# EAGLE schematic mrShark Programmer (EAGLE 6.1)
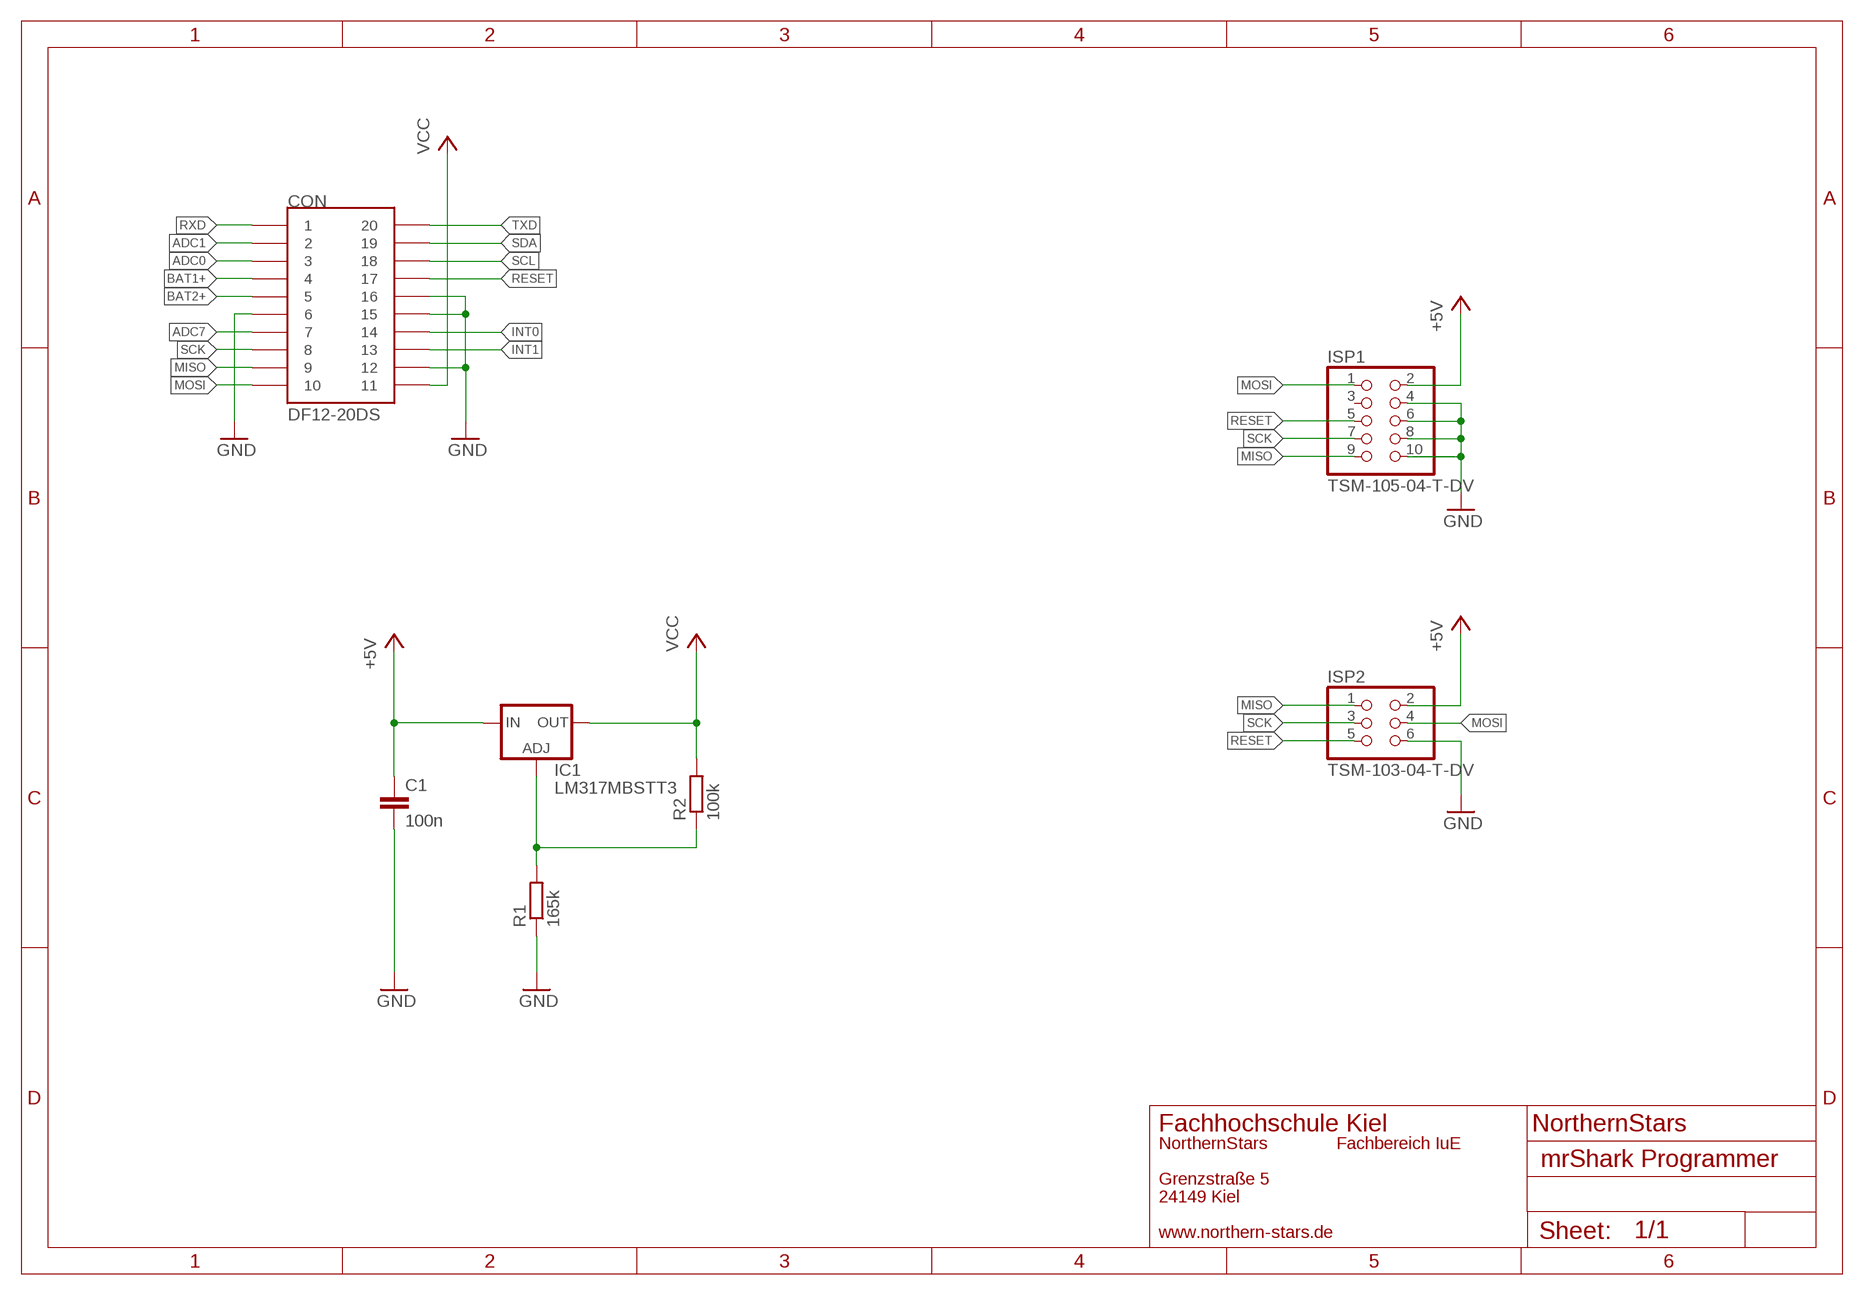
[diagram p0: schematic, sheet 1]

## Parts
C1  100n  C-EUC0201  [C0201]
CON  DF12-20DS  [DF12-20DS]
IC1  LM317MBSTT3  [SOT223]
ISP1  TSM-105-04-T-DV  PINHD-2X05_2.54-SMD  [2X05SMD]
ISP2  TSM-103-04-T-DV  PINHD-2X03_2.54-SMD  [2X03SMD]
R1  165k  R-EU_R0201  [R0201]
R2  100k  R-EU_R0201  [R0201]

## Nets
+5V: C1.1 IC1.3(IN) ISP1.2 ISP2.2
ADC0: CON.3
ADC1: CON.2
ADC7: CON.7
BAT1+: CON.4
BAT2+: CON.5
GND: C1.2 CON.6 CON.12 CON.15 CON.16 ISP1.4 ISP1.6 ISP1.8 ISP1.10 ISP2.6 R1.1
INT0: CON.14
INT1: CON.13
MISO: CON.9 ISP1.9 ISP2.1
MOSI: CON.10 ISP1.1 ISP2.4
N$3: IC1.1(ADJ) R1.2 R2.1
RESET: CON.17 ISP1.5 ISP2.5
RXD: CON.1
SCK: CON.8 ISP1.7 ISP2.3
SCL: CON.18
SDA: CON.19
TXD: CON.20
VCC: CON.11 IC1.4(OUT) R2.2
Unconnected: ISP1.3

## Notes on the sheet
- Fachhochschule Kiel | NorthernStars
- NorthernStars | Fachbereich IuE
- Grenzstraße 5
- 24149 Kiel
- www.northern-stars.de

## Library data of the parts
C1 = rcl:C-EU: CAPACITOR, European symbol
CON = con-hirose:DF12-20: HRS-Hirose DF12-Series 0.5mm Pitch SMT Board to Board Connector 20 contacts
IC1 = v-reg:LM317?*: 500 mA Adjustable Output Positive Voltage Regulator Source: http://www.onsemi.co.jp .. LM317M-D.PDF
ISP1 = pinhead-2:PINHD-2X05: PIN HEADER
ISP2 = pinhead-2:PINHD-2X03: PIN HEADER
R1 R2 = rcl:R-EU_: RESISTOR, European symbol